# EAGLE design FuelGauge (EAGLE 9.6.2)
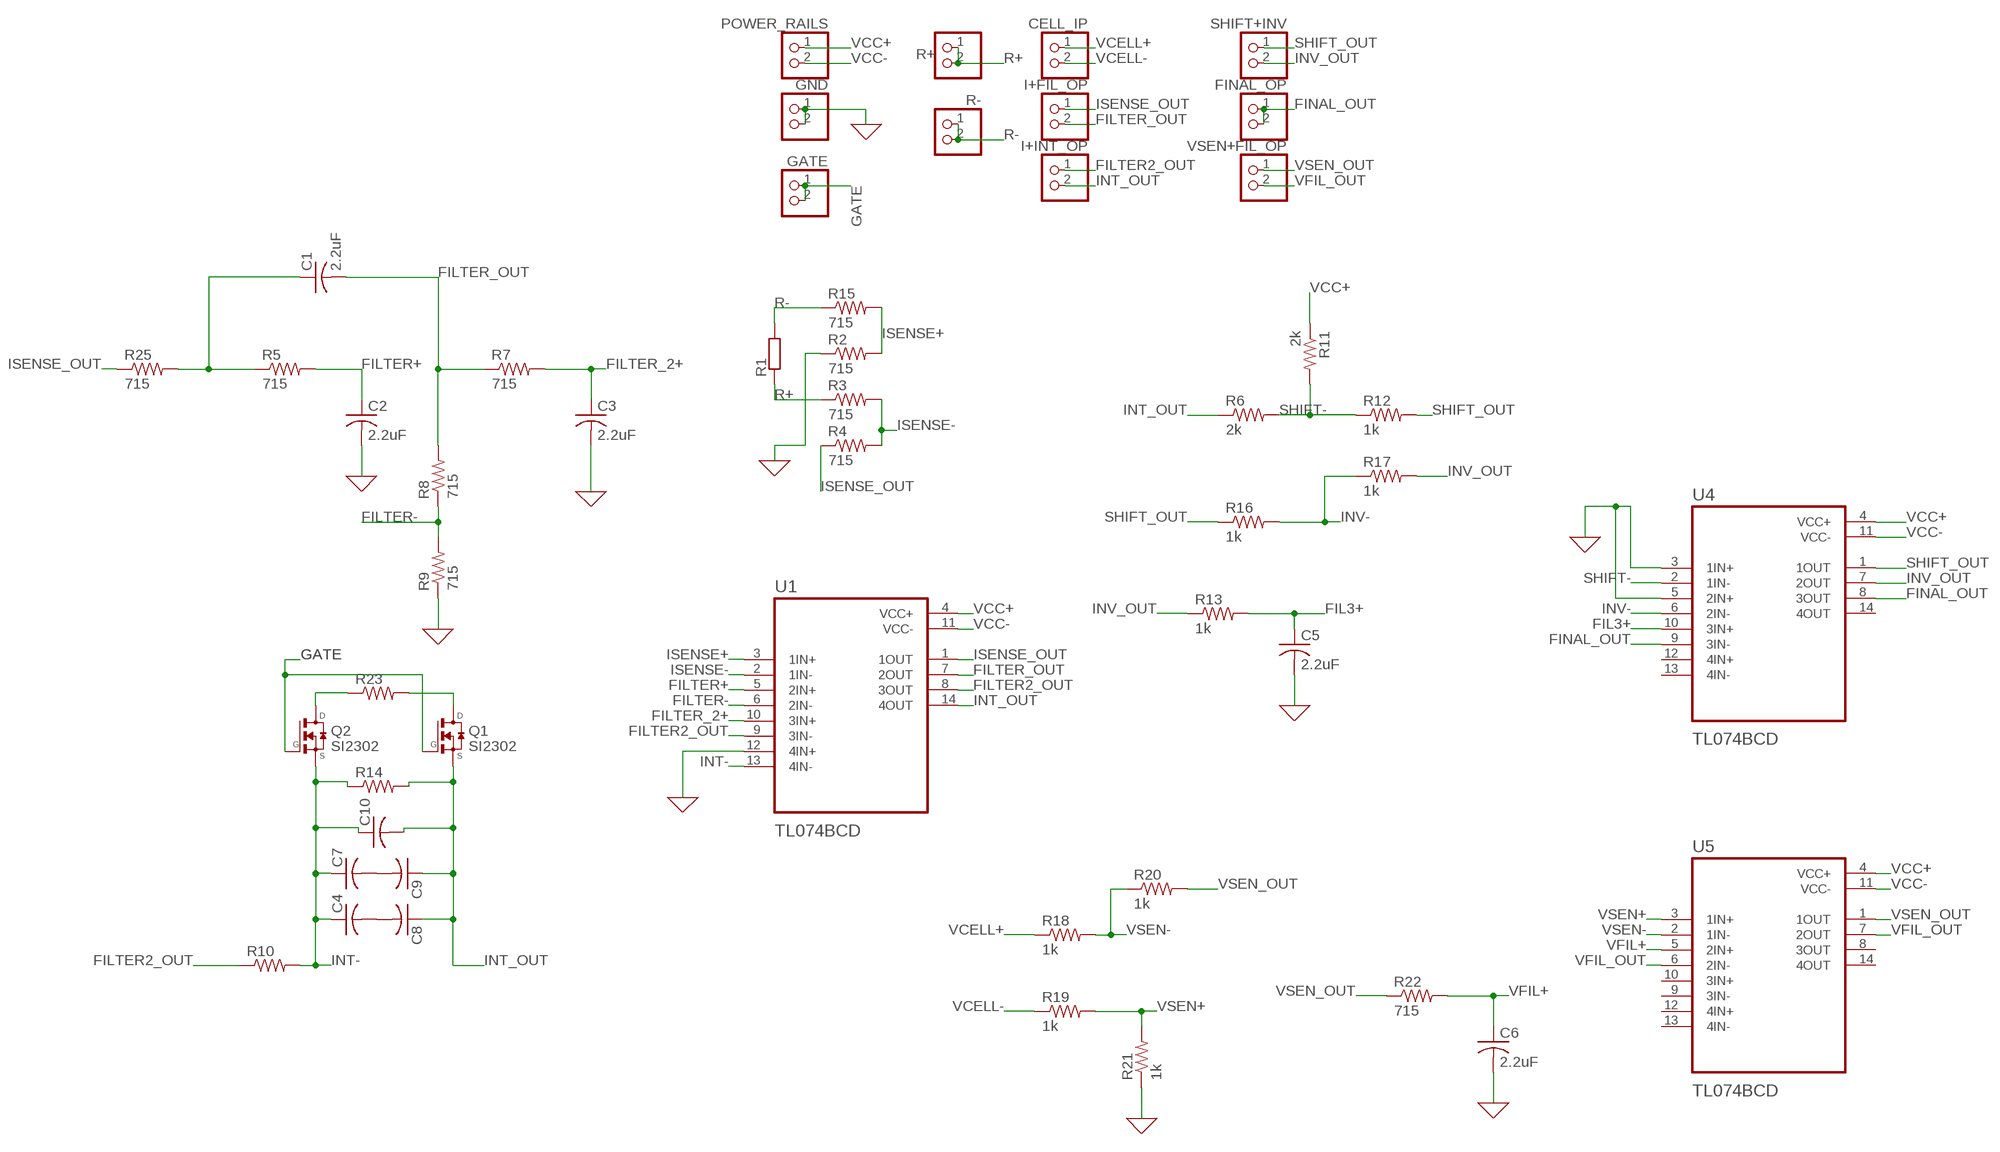
[diagram p0: schematic, sheet 1]

## Parts
C1  2.2uF  C-USC0603  [C0603]
C2  2.2uF  C-USC0603  [C0603]
C3  2.2uF  C-USC0603  [C0603]
C4  C-US025-050X050  [C025-050X050]
C5  2.2uF  C-USC0603  [C0603]
C6  2.2uF  C-USC0603  [C0603]
C7  C-US025-050X050  [C025-050X050]
C8  C-US025-050X050  [C025-050X050]
C9  C-US025-050X050  [C025-050X050]
C10  C-USC0603  [C0603]
CELL_IP  PINHD-1X2  [1X02]
FINAL_OP  PINHD-1X2  [1X02]
GATE  PINHD-1X2  [1X02]
GND  PINHD-1X2  [1X02]
I+FIL_OP  PINHD-1X2  [1X02]
I+INT_OP  PINHD-1X2  [1X02]
POWER_RAILS  PINHD-1X2  [1X02]
Q1  SI2302  [SOT23]
Q2  SI2302  [SOT23]
R1  SMS-0  [SMS-0]
R2  715  R-US_R0402  [R0402]
R3  715  R-US_R0402  [R0402]
R4  715  R-US_R0402  [R0402]
R5  715  R-US_R0402  [R0402]
R6  2k  R-US_R0402  [R0402]
R7  715  R-US_R0402  [R0402]
R8  715  R-US_R0402  [R0402]
R9  715  R-US_R0402  [R0402]
R10  R-US_R0402  [R0402]
R11  2k  R-US_R0402  [R0402]
R12  1k  R-US_R0402  [R0402]
R13  1k  R-US_R0402  [R0402]
R14  R-US_R0402  [R0402]
R15  715  R-US_R0402  [R0402]
R16  1k  R-US_R0402  [R0402]
R17  1k  R-US_R0402  [R0402]
R18  1k  R-US_R0402  [R0402]
R19  1k  R-US_R0402  [R0402]
R20  1k  R-US_R0402  [R0402]
R21  1k  R-US_R0402  [R0402]
R22  715  R-US_R0402  [R0402]
R23  R-US_R0402  [R0402]
R25  715  R-US_R0402  [R0402]
R+  PINHD-1X2  [1X02]
R-  PINHD-1X2  [1X02]
SHIFT+INV  PINHD-1X2  [1X02]
U1  TL074BCD  [SOIC127P600X175-14N]
U4  TL074BCD  [SOIC127P600X175-14N]
U5  TL074BCD  [SOIC127P600X175-14N]
VSEN+FIL_OP  PINHD-1X2  [1X02]

## Nets
0: C2.2 C3.2 C5.2 C6.2 GND.1 GND.2 R2.1 R9.1 R21.1 U1.12(4IN+) U4.3(1IN+) U4.5(2IN+) ; supply symbol labelled GND
FIL3+: C5.1 R13.2 U4.10(3IN+)
FILTER2_OUT: I+INT_OP.1 R10.1 U1.8(3OUT) U1.9(3IN-)
FILTER+: C2.1 R5.2 U1.5(2IN+)
FILTER-: R8.1 R9.2 U1.6(2IN-)
FILTER_2+: C3.1 R7.2 U1.10(3IN+)
FILTER_OUT: C1.2 I+FIL_OP.2 R7.1 R8.2 U1.7(2OUT)
FINAL_OUT: FINAL_OP.1 FINAL_OP.2 U4.8(3OUT) U4.9(3IN-)
GATE: GATE.1 GATE.2 Q1.1(G) Q2.1(G)
INT-: C4.1 C7.1 C10.1 Q2.2(S) R10.2 R14.1 U1.13(4IN-)
INT_OUT: I+INT_OP.2 R6.1 U1.14(4OUT)
INV-: R16.2 R17.1 U4.6(2IN-)
INV_OUT: R13.1 R17.2 SHIFT+INV.2 U4.7(2OUT)
ISENSE+: R2.2 R15.2 U1.3(1IN+)
ISENSE-: R3.2 R4.2 U1.2(1IN-)
ISENSE_OUT: I+FIL_OP.1 R4.1 R25.1 U1.1(1OUT)
N$1: Q1.3(D) R23.2
N$2: C4.2 C8.2
N$3: Q2.3(D) R23.1
N$4: C7.2 C9.2
N$7: C1.1 R5.1 R25.2
N$16: C8.1 C9.1 C10.2 Q1.2(S) R14.2
R+ [Current_Sense]: R1.2 R3.1 R+.1 R+.2
R- [Current_Sense]: R1.1 R15.1 R-.1 R-.2
SHIFT-: R6.2 R11.2 R12.1 U4.2(1IN-)
SHIFT_OUT: R12.2 R16.1 SHIFT+INV.1 U4.1(1OUT)
VCC+ [Power]: POWER_RAILS.1 R11.1 U1.4(VCC+) U4.4(VCC+) U5.4(VCC+)
VCC- [Power]: POWER_RAILS.2 U1.11(VCC-) U4.11(VCC-) U5.11(VCC-)
VCELL+: CELL_IP.1 R18.1
VCELL-: CELL_IP.2 R19.1
VFIL+: C6.1 R22.2 U5.5(2IN+)
VFIL_OUT: U5.6(2IN-) U5.7(2OUT) VSEN+FIL_OP.2
VSEN+: R19.2 R21.2 U5.3(1IN+)
VSEN-: R18.2 R20.1 U5.2(1IN-)
VSEN_OUT: R20.2 R22.1 U5.1(1OUT) VSEN+FIL_OP.1
Unconnected: U4.12(4IN+) U4.13(4IN-) U4.14(4OUT) U5.8(3OUT) U5.9(3IN-) U5.10(3IN+) U5.12(4IN+) U5.13(4IN-) U5.14(4OUT)

## Library data of the parts
C1-C10 = rcl:C-US: CAPACITOR, American symbol; SPICEPREFIX: C
CELL_IP FINAL_OP GATE GND I+FIL_OP I+INT_OP POWER_RAILS R+ R- SHIFT+INV VSEN+FIL_OP = pinhead:PINHD-1X2: PIN HEADER
Q1 Q2 = SI2302:SI2302: Check availability <https://pricing.snapeda.com/parts/SI2302/Vishay%20Siliconix/view-part?ref=eda>; AVAILABILITY: Not in stock; CHECK_PRICES: https://www.snapeda.com/parts/SI2302/Vishay/view-part/?ref=eda; DESCRIPTION: N-Channel 20 V 2.6A (Ta) 710mW (Ta) Surface Mount SOT-23-3 (TO-236); MF: Vishay Siliconix; MP: SI2302; PACKAGE: SOT-23-3 Vishay Siliconix; PRICE: None; SNAPEDA_LINK: https://www.snapeda.com/parts/SI2302/Vishay/view-part/?ref=snap
R1 = resistor-shunt:SMS-0: SMD SHUNT RESISTOR; OC_FARNELL: unknown; OC_NEWARK: unknown
R2-R23 R25 = rcl:R-US_: RESISTOR, American symbol; SPICEPREFIX: R
U1 U4 U5 = New_OP_AMP:TL074BCD: Check availability <https://pricing.snapeda.com/parts/TL074BCD/Texas%20Instruments/view-part?ref=eda>; AVAILABILITY: In Stock; CHECK_PRICES: https://www.snapeda.com/parts/TL074BCD/Texas+Instruments/view-part/?ref=eda; DESCRIPTION: Quad, 30-V, 3-MHz, high slew rate (13-V/µs), 3-mV offset voltage, In to V+, JFET-input op amp; MF: Texas Instruments; MP: TL074BCD; PACKAGE: SOIC-14 Texas Instruments; PRICE: None; SNAPEDA_LINK: https://www.snapeda.com/parts/TL074BCD/Texas+Instruments/view-part/?ref=snap

## Net classes
0 default: width 0.254 mm, drill 0.203 mm, clearance 0.152 mm
1 Power: width 0.305 mm, drill 0.305 mm, clearance 0.152 mm
2 Current_Sense: width 0.254 mm, drill 0.203 mm, clearance 0.152 mm

## Board
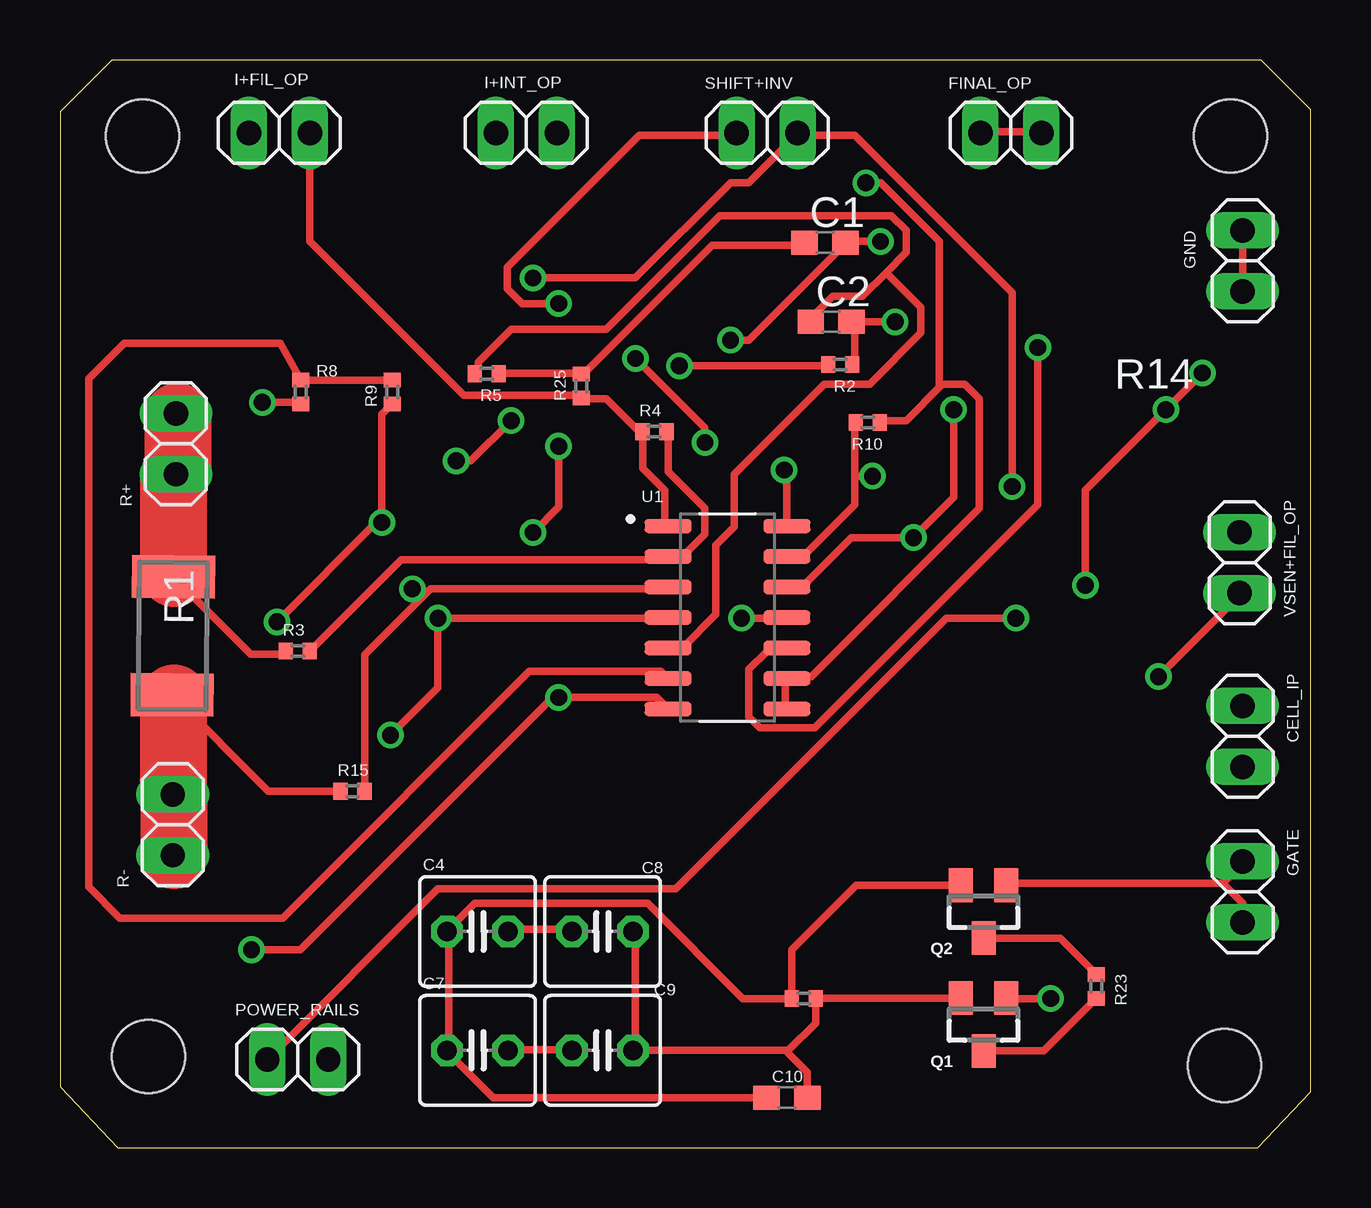
[diagram p1: board, top side]
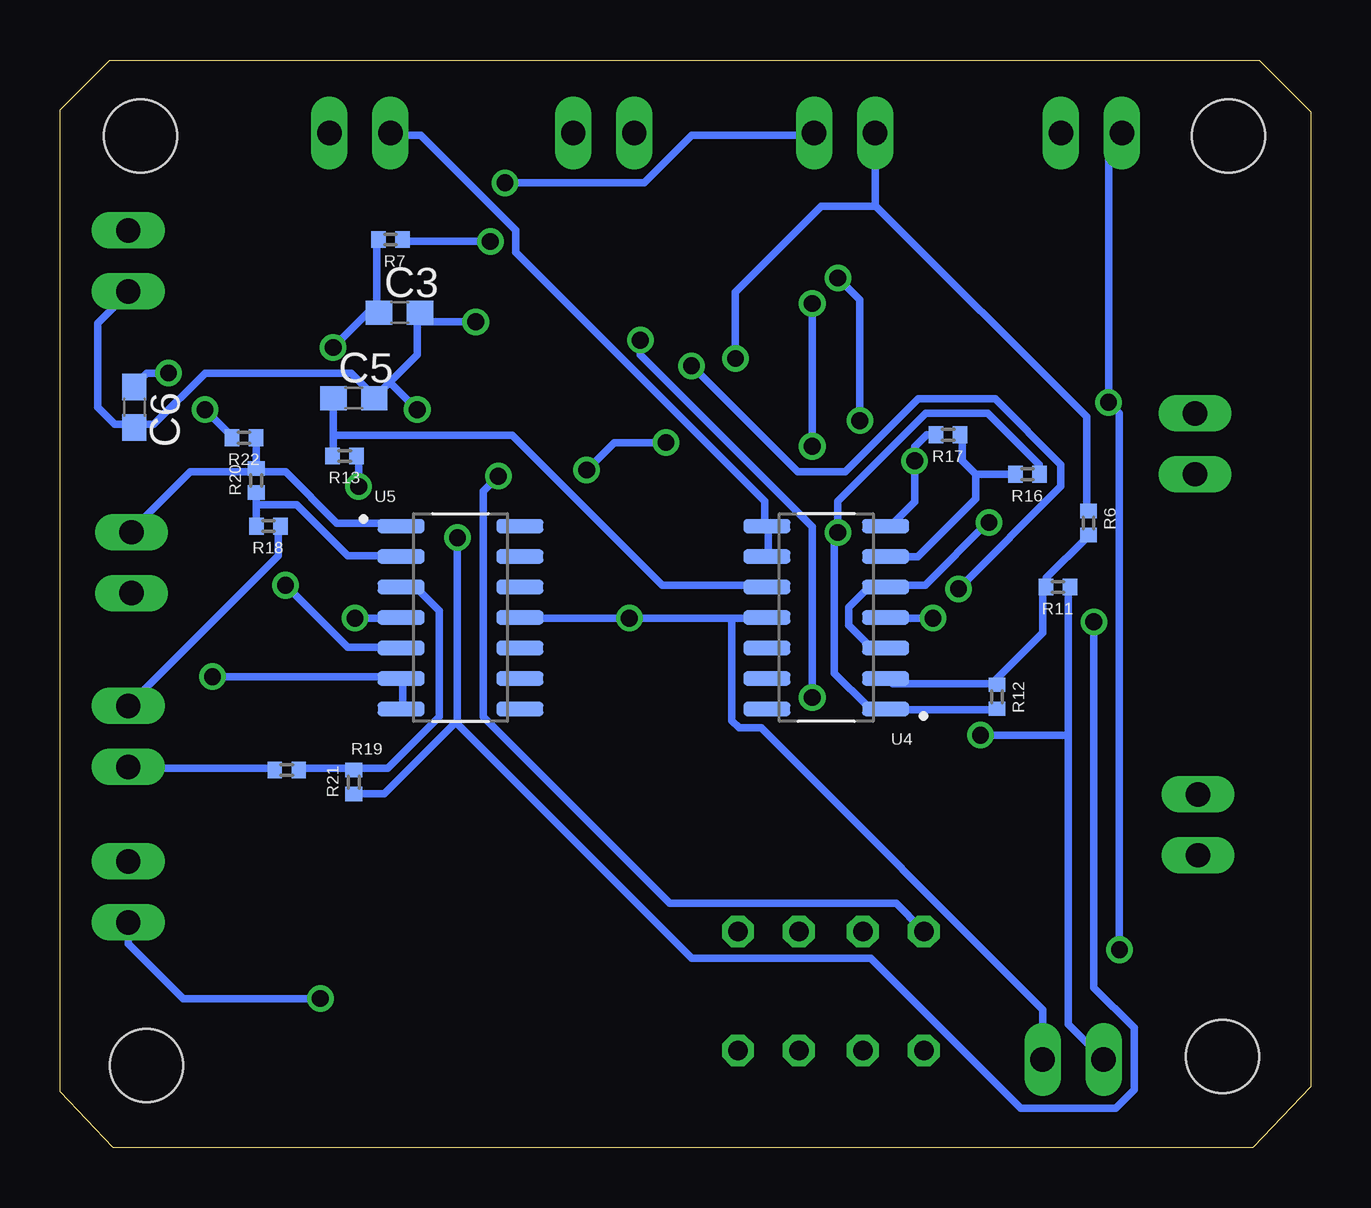
[diagram p2: board, bottom side, seen from below]

Size 52.12 x 45.33 mm. Coordinates in mm from the lower left corner, seen from the top.
Outline: 2.41,0 49.91,0 52.12,2.34 52.12,43.26 50.05,45.33 2.15,45.33 0,43.18 0,2.54 2.41,0
Copper layers (1*16): Top 0.035mm / dielectric 1.5mm / Bottom 0.035mm
Design rules "default *": minimum track width 12mil, minimum drill 0.7mm, track to track 12mil, track to pad 12mil, pad to pad 12mil, via to via 12mil, smd to smd 12mil, copper to edge 40mil, drill to drill 10mil, minimum pad ring 10mil, minimum via ring 8mil, stop-mask expansion 4mil, vias tented up to drill 0mil, thermal gap 10mil
Holes 3.05 mm at 3.43,42.16 3.68,3.81 48.77,42.16 48.51,3.43

### Footprints (pad centres in the part's own frame; a part is rotated, then mirrored left to right if it is on the bottom)
C0603 = smd 1.1 x 1: 1 -0.85,0; 2 0.85,0
C025-050X050 = drill 0.813 octagon: 1 -1.27,0; 2 1.27,0
1X02 = drill 1.016 long: 1 -1.27,0; 2 1.27,0
SOT23 = smd 1 x 1.4: 1 -0.95,-1.1; 2 0.95,-1.1; 3 0,1.1
SMS-0 = smd 1.8 x 3.45: 1 2.464,0; 2 -2.464,0
R0402 = smd 0.6 x 0.7: 1 -0.5,0; 2 0.5,0
SOIC127P600X175-14N = smd 1.97 x 0.6: 1 -2.475,3.81; 2 -2.475,2.54; 3 -2.475,1.27; 4 -2.475,0; 5 -2.475,-1.27; 6 -2.475,-2.54; 7 -2.475,-3.81; 8 2.475,-3.81; 9 2.475,-2.54; 10 2.475,-1.27; 11 2.475,0; 12 2.475,1.27; 13 2.475,2.54; 14 2.475,3.81

### Placement (x,y rotation side)
C1  31.88,37.72 0 top
C2  32.13,34.42 0 top
C3  37.97,34.8 0 bottom
C4  17.4,9.02 0 top
C5  39.88,31.24 0 bottom
C6  49.02,30.86 270 bottom
C7  17.4,4.06 0 top
C8  22.61,9.02 180 top
C9  22.61,4.06 180 top
C10  30.29,2.1 0 top
CELL_IP  49.28,17.15 270 top
FINAL_OP  39.62,42.29 0 top
GATE  49.28,10.67 270 top
GND  49.28,36.96 90 top
I+FIL_OP  9.14,42.29 180 top
I+INT_OP  19.43,42.29 180 top
POWER_RAILS  9.91,3.68 0 top
Q1  38.48,5.14 180 top
Q2  38.48,9.84 180 top
R1  4.7,21.34 269.4 top
R2  32.51,32.64 180 top
R3  9.91,20.7 0 top
R4  24.77,29.84 0 top
R5  17.78,32.26 180 top
R6  9.27,26.04 270 bottom
R7  38.35,37.85 180 bottom
R8  10.03,31.5 270 top
R9  13.84,31.5 90 top
R10  33.66,30.23 180 top
R11  10.54,23.37 180 bottom
R12  13.08,18.8 270 bottom
R13  40.26,28.83 180 bottom
R14  30.99,6.22 0 top
R15  12.19,14.86 0 top
R16  11.81,28.07 180 bottom
R17  15.11,29.72 180 bottom
R18  43.43,25.91 180 bottom
R19  42.67,15.75 0 bottom
R20  43.94,27.81 90 bottom
R21  39.88,15.24 90 bottom
R22  44.45,29.59 180 bottom
R23  43.18,6.73 270 top
R25  21.72,31.75 90 top
R+  4.83,29.34 90 top
R-  4.7,13.46 90 top
SHIFT+INV  29.46,42.29 0 top
U1  27.81,22.1 0 top
U4  20.19,22.1 180 bottom
U5  35.43,22.1 0 bottom
VSEN+FIL_OP  49.15,24.38 270 top

### Tracks (layer width: path | path; a pad name or v marks a point on that pad's centre or on a via)
0  (via drill 0.7)
  Top 0.305: 33.12,34.42 33.12,32.74 R2.1 | v34.8,34.42 33.12,34.42 | 33.12,34.42 C2.2 | GND.1 GND.2 | R9.1 13.41,30.56 v13.41,26.06 13.18,26.06 v9.04,21.92 | U1.12 30.38,23.44 30.99,23.44 32.97,25.43 v35.56,25.43 37.24,27.1 v37.24,30.76
  Bottom 0.305: 37.24,34.42 37.24,33.05 38.38,31.9 | 37.24,34.42 37.24,34.72 C3.2 37.24,34.42 | 38.38,31.9 38.91,31.37 C5.2 39.06,31.37 39.98,32.28 46.08,32.28 48.21,30.15 48.97,30.15 | 37.24,34.42 v34.8,34.42 | GND.1 49.28,35.64 50.55,34.37 50.55,30.86 49.83,30.15 48.97,30.15 | 48.97,30.15 C6.2 | v13.41,26.06 13.46,26.06 16.08,23.44 17.58,23.44 U4.5 17.73,23.29 18.49,23.29 19.25,22.53 19.25,21.77 18.34,20.85 17.73,20.85 U4.3 | 35.64,17.73 35.56,17.8 v35.56,25.43 | 35.64,17.73 38.61,14.76 39.83,14.76 R21.1 | v9.04,21.92 9.04,6.68 7.37,5 7.37,2.41 8.13,1.65 12.09,1.65 18.34,7.9 25.81,7.9 35.64,17.73 | v37.24,30.76 38.38,31.9
FIL3+
  Bottom 0.305: 40.74,29.69 40.74,31.22 C5.1 | 40.74,29.69 40.74,28.93 R13.2 | 40.74,29.69 33.27,29.69 27.03,23.44 22.76,23.44 U4.10
FILTER2_OUT  (via drill 0.7)
  Top 0.305: 36.7,31.75 36.78,31.83 37.69,31.83 38.3,31.22 38.3,26.65 31.29,19.63 30.38,19.63 U1.9 30.23,19.48 30.23,18.41 U1.8 | 36.7,31.75 35.25,30.3 34.19,30.3 R10.1 | v33.58,40.21 34.19,40.21 36.63,37.77 36.63,31.83 36.7,31.75
  Bottom 0.305: v33.58,40.21 27.79,40.21 25.81,42.19 20.78,42.19 I+INT_OP.1
FILTER+
  Top 0.305: 34.42,36.47 33.43,35.48 32.21,35.48 31.14,34.42 C2.1 | 34.42,36.47 35.25,37.31 35.25,38.23 34.65,38.84 27.48,38.84 22.76,34.11 18.8,34.11 17.42,32.74 17.42,32.28 R5.2 | 34.42,36.47 35.86,35.03 35.86,33.96 33.73,31.83 31.85,31.83 28.09,28.07 28.09,25.88 27.33,25.12 27.33,22.23 25.96,20.85 25.35,20.85 U1.5
FILTER-
  Top 0.305: R9.2 13.77,31.98 10.11,31.98 R8.1 9.17,33.53 2.67,33.53 1.19,32.05 1.19,10.87 2.49,9.58 9.27,9.58 19.56,19.86 25.03,19.86 U1.6
FILTER_2+  (via drill 0.7)
  Top 0.305: v40.74,33.35 40.74,26.8 31.45,17.5 29.16,17.5 28.7,17.96 28.7,19.94 29.46,20.7 30.23,20.7 U1.10
  Bottom 0.305: R7.2 38.91,37.77 38.91,34.87 C3.1 39.06,34.87 39.22,34.87 v40.74,33.35
FILTER_OUT  (via drill 0.7)
  Top 0.305: v34.19,37.77 32.82,37.77 C1.2 32.66,37.62 28.7,33.66 v27.94,33.66 | v8.43,31.06 9.96,31.06 R8.2 | U1.7 24.86,18.77 v20.78,18.77 20.52,18.77 10.01,8.26 v7.98,8.26
  Bottom 0.305: v34.19,37.77 37.85,37.77 R7.1 | I+FIL_OP.2 8.43,41.73 v8.43,31.06 7.98,30.61 v7.98,8.26 | v27.94,33.66 27.94,33.05 20.78,25.88 v20.78,18.77
FINAL_OUT
  Top 0.305: FINAL_OP.2 40.89,42.34 38.46,42.34 FINAL_OP.1
  Bottom 0.305: U4.9 22.61,24.66 22.61,25.88 U4.8 22.76,26.04 22.76,26.95 33.12,37.31 33.12,38.23 37.08,42.19 38.3,42.19 FINAL_OP.1
GATE  (via drill 0.7)
  Top 0.305: 48.44,11.02 49.28,11.86 GATE.1 | GATE.2 49.28,10.19 48.44,11.02 | Q1.1 39.46,6.22 v41.27,6.22 | 48.44,11.02 39.51,11.02 Q2.1
  Bottom 0.305: GATE.2 49.28,8.51 46.99,6.22 v41.27,6.22
INT-  (via drill 0.7)
  Top 0.305: C10.1 18.05,2.09 16.2,3.94 C7.1 16.2,4.09 16.2,8.97 C4.1 16.2,9.12 17.27,10.19 24.49,10.19 28.45,6.22 R14.1 30.49,8.26 33.17,10.94 Q2.2 | 33.12,27.99 33.12,26.8 30.99,24.66 30.38,24.66 U1.13 | 33.12,27.99 33.12,30.15 R10.2 | v33.86,27.99 33.12,27.99
  Bottom 0.305: v33.86,27.99 34.49,27.36 34.49,17.96 26.72,10.19 17.27,10.19 16.2,9.12 C4.1
INT_OUT  (via drill 0.7)
  Top 0.305: U1.14 30.29,28.13 v30.18,28.25 | v26.87,29.39 26.87,30 v23.98,32.89
  Bottom 0.305: R6.1 9.35,26.65 9.35,30.45 18.14,39.24 | v30.18,28.25 29.03,29.39 v26.87,29.39 | v23.98,32.89 23.98,35.66 20.4,39.24 18.14,39.24 | I+INT_OP.2 18.16,39.27 18.14,39.24
INV-
  Bottom 0.305: R17.1 14.53,29.69 14.53,28.63 13.97,28.07 | U4.6 17.58,24.66 17.55,24.64 16.38,24.64 13.97,27.05 13.97,28.07 | R16.2 13.97,28.07
INV_OUT  (via drill 0.7)
  Top 0.305: v39.67,27.56 39.67,35.64 33.12,42.19 30.84,42.19 SHIFT+INV.2 30.68,42.19 28.7,40.21 27.94,40.21 23.98,36.25 v19.71,36.25 | v16.51,28.63 17.12,28.63 v18.8,30.3
  Bottom 0.305: U4.7 17.58,26.04 17.4,26.04 16.51,26.92 v16.51,28.63 16.51,29.21 16,29.72 R17.2 | v39.67,27.56 39.67,28.78 R13.1 | v18.8,30.3 18.8,35.33 v19.71,36.25
ISENSE+  (via drill 0.7)
  Top 0.305: 15.06,22.91 15.44,23.29 25.2,23.29 U1.3 | 15.06,22.91 12.7,20.55 12.7,14.91 R15.2 | v25.81,32.59 31.9,32.59 R2.2 | 15.06,22.91 v14.68,23.29
  Bottom 0.305: v25.81,32.59 21.39,28.17 19.41,28.17 16.36,31.22 13.16,31.22 10.41,28.47 10.41,27.56 v14.68,23.29
ISENSE-
  Top 0.305: R3.2 14.22,24.51 25.2,24.51 U1.2 25.35,24.66 25.96,24.66 26.87,25.58 26.87,26.65 25.35,28.17 25.35,29.84 R4.2
ISENSE_OUT
  Top 0.305: U1.1 25.2,26.04 25.2,27.41 24.28,28.32 24.28,29.84 R4.1 24.13,29.84 22.76,31.22 21.84,31.22 R25.1 21.69,31.37 16.82,31.37 10.41,37.77 I+FIL_OP.1
N$1
  Top 0.305: Q1.3 40.99,4.04 R23.2
N$2
  Top 0.305: C4.2 18.8,9.12 21.23,9.12 C8.2
N$3
  Top 0.305: Q2.3 41.67,8.74 R23.1
N$4
  Top 0.305: C7.2 18.8,4.09 21.23,4.09 C9.2
N$7
  Top 0.305: R5.1 18.34,32.28 21.69,32.28 R25.2 21.84,32.28 27.18,37.62 30.99,37.62 C1.1
N$16
  Top 0.305: C8.1 23.98,8.97 23.98,4.24 C9.1 30.35,4.06 | 30.35,4.06 30.35,3.94 31.14,3.15 C10.2 | 30.35,4.06 31.49,5.2 R14.2 31.51,6.24 Q1.2
R+
  Top 0.305: 4.9,28.19 R+.1 4.75,28.04 | 4.9,30.48 R+.2 | R3.1 9.28,20.57 7.95,20.57 4.75,23.77 R1.2 4.75,23.93
  Top 2.794: 4.9,30.48 4.9,28.19 | 4.75,23.93 4.75,28.04
R-
  Top 0.305: 4.75,12.19 R-.1 | 4.75,14.63 R-.2 4.75,14.78 | 4.75,18.75 R1.1 8.69,14.86 R15.1
  Top 2.794: 4.75,14.63 4.75,12.19 | 4.75,14.78 4.75,18.75
SHIFT-
  Bottom 0.305: R6.2 9.35,25.43 11.02,23.75 11.02,23.44 R11.2 11.18,23.29 11.18,21.46 13.16,19.48 R12.1 13.16,19.33 17.42,19.33 17.58,19.48 U4.2
SHIFT_OUT  (via drill 0.7)
  Top 0.305: v20.78,35.18 19.25,35.18 18.64,35.79 18.64,36.7 24.13,42.19 28.09,42.19 SHIFT+INV.1 | v20.78,29.23 20.78,26.71 v19.71,25.64
  Bottom 0.305: R12.2 13.16,18.26 17.58,18.26 U4.1 17.73,18.41 18.49,18.41 19.86,19.79 19.86,25.49 v19.71,25.64 19.71,26.95 16.05,30.61 13.46,30.61 11.33,28.47 11.33,28.17 R16.1 | v20.78,29.23 v20.78,35.18
VCC+  (via drill 0.7)
  Top 0.305: U1.4 25.2,22.07 v15.75,22.07 15.75,19.18 v13.77,17.2 | v39.83,22.07 36.93,22.07 25.65,10.79 15.75,10.79 POWER_RAILS.1
  Bottom 0.305: v15.75,22.07 17.58,22.07 U4.4 | 10.11,17.2 10.11,5.16 POWER_RAILS.1 | 10.11,17.2 10.11,23.29 R11.1 | v39.83,22.07 38,22.07 U5.4 | 10.11,17.2 v13.77,17.2
VCC-  (via drill 0.7)
  Top 0.305: v28.4,22.07 30.23,22.07 U1.11
  Bottom 0.305: 24.13,22.07 v28.4,22.07 32.82,22.07 U5.11 | 24.13,22.07 22.76,22.07 U4.11 | POWER_RAILS.2 11.18,5.77 22.91,17.5 23.82,17.5 24.13,17.8 24.13,22.07
VCELL+
  Bottom 0.305: CELL_IP.1 43.03,24.66 43.03,25.88 R18.1
VCELL-
  Bottom 0.305: R19.1 43.18,15.82 49.28,15.82 CELL_IP.2
VFIL+  (via drill 0.7)
  Top 0.305: v47.6,32.28 v46.08,30.76 42.72,27.41 v42.72,23.44
  Bottom 0.305: v46.08,30.76 45.01,29.69 R22.2 | v47.6,32.28 48.51,32.28 48.97,31.83 C6.1 | v42.72,23.44 40.13,20.85 38,20.85 U5.5
VFIL_OUT  (via drill 0.7)
  Top 0.305: v45.77,19.63 49.12,22.99 VSEN+FIL_OP.2
  Bottom 0.305: U5.7 37.85,18.41 37.85,19.48 U5.6 38,19.63 v45.77,19.63
VSEN+
  Bottom 0.305: R19.2 42.11,15.82 39.98,15.82 R21.2 39.83,15.82 38.46,15.82 36.32,17.96 36.32,22.38 37.24,23.29 37.85,23.29 U5.3
VSEN-
  Bottom 0.305: R20.1 43.94,26.8 | 43.94,26.8 43.94,26.04 R18.2 | 43.94,26.8 42.27,26.8 40.13,24.66 38,24.66 U5.2
VSEN_OUT
  Bottom 0.305: R22.1 43.94,29.54 R20.2 43.94,28.17 | 43.94,28.17 46.68,28.17 49.12,25.73 VSEN+FIL_OP.1 | 43.94,28.17 42.72,28.17 40.59,26.04 38,26.04 U5.1